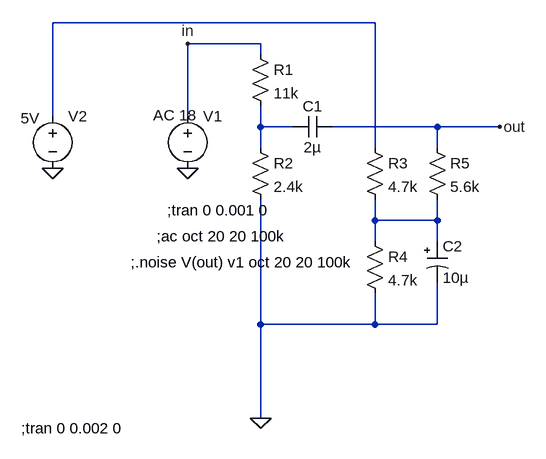
[diagram p0: schematic Spannungsteiler.asc]
Spannungsteiler.asc, the LTspice schematic file:
Version 4
SHEET 1 880 680
WIRE 320 0 -176 0
WIRE 144 32 32 32
WIRE 144 48 144 32
WIRE -176 144 -176 0
WIRE 32 144 32 32
WIRE 144 160 144 128
WIRE 192 160 144 160
WIRE 416 160 256 160
WIRE 512 160 416 160
WIRE 144 192 144 160
WIRE 320 192 320 0
WIRE 416 192 416 160
WIRE 320 304 320 272
WIRE 416 304 416 272
WIRE 416 304 320 304
WIRE 320 336 320 304
WIRE 416 336 416 304
WIRE 144 464 144 272
WIRE 320 464 320 416
WIRE 320 464 144 464
WIRE 416 464 416 400
WIRE 416 464 320 464
WIRE 144 608 144 464
FLAG 32 224 0
FLAG 144 608 0
FLAG 512 160 out
FLAG 32 32 in
FLAG -176 224 0
SYMBOL voltage 32 128 R0
WINDOW 3 -36 131 Left 2
WINDOW 123 -53 14 Left 2
WINDOW 39 0 0 Left 0
SYMATTR Value ""
SYMATTR Value2 AC 18
SYMATTR InstName V1
SYMBOL res 128 32 R0
SYMATTR InstName R1
SYMATTR Value 11k
SYMBOL res 128 176 R0
SYMATTR InstName R2
SYMATTR Value 2.4k
SYMBOL cap 256 144 R90
WINDOW 0 0 32 VBottom 2
WINDOW 3 32 32 VTop 2
SYMATTR InstName C1
SYMATTR Value 2µ
SYMBOL res 304 176 R0
SYMATTR InstName R3
SYMATTR Value 4.7k
SYMBOL res 304 320 R0
SYMATTR InstName R4
SYMATTR Value 4.7k
SYMBOL voltage -176 128 R0
WINDOW 3 -49 19 Left 2
WINDOW 123 0 0 Left 0
WINDOW 39 0 0 Left 0
SYMATTR Value 5V
SYMATTR InstName V2
SYMBOL res 400 176 R0
SYMATTR InstName R5
SYMATTR Value 5.6k
SYMBOL polcap 400 336 R0
SYMATTR InstName C2
SYMATTR Value 10µ
TEXT 0 288 Left 2 !;tran 0 0.001 0
TEXT -16 328 Left 2 !;ac oct 20 20 100k
TEXT -224 624 Left 2 !;tran 0 0.002 0
TEXT -56 368 Left 2 !;.noise V(out) v1 oct 20 20 100k

The netlist it stands for:
* Spannungsteiler.asc
V1 in 0 AC 18
R1 in N002 11k
R2 N002 0 2.4k
C1 out N002 2µ
R3 N001 N003 4.7k
R4 N003 0 4.7k
V2 N001 0 5V
R5 out N003 5.6k
C2 N003 0 10µ
;tran 0 0.001 0
;ac oct 20 20 100k
;tran 0 0.002 0
;.noise V(out) v1 oct 20 20 100k
.backanno
.end